# Altium schematic sheet Sheet2.SchDoc
size Tabloid
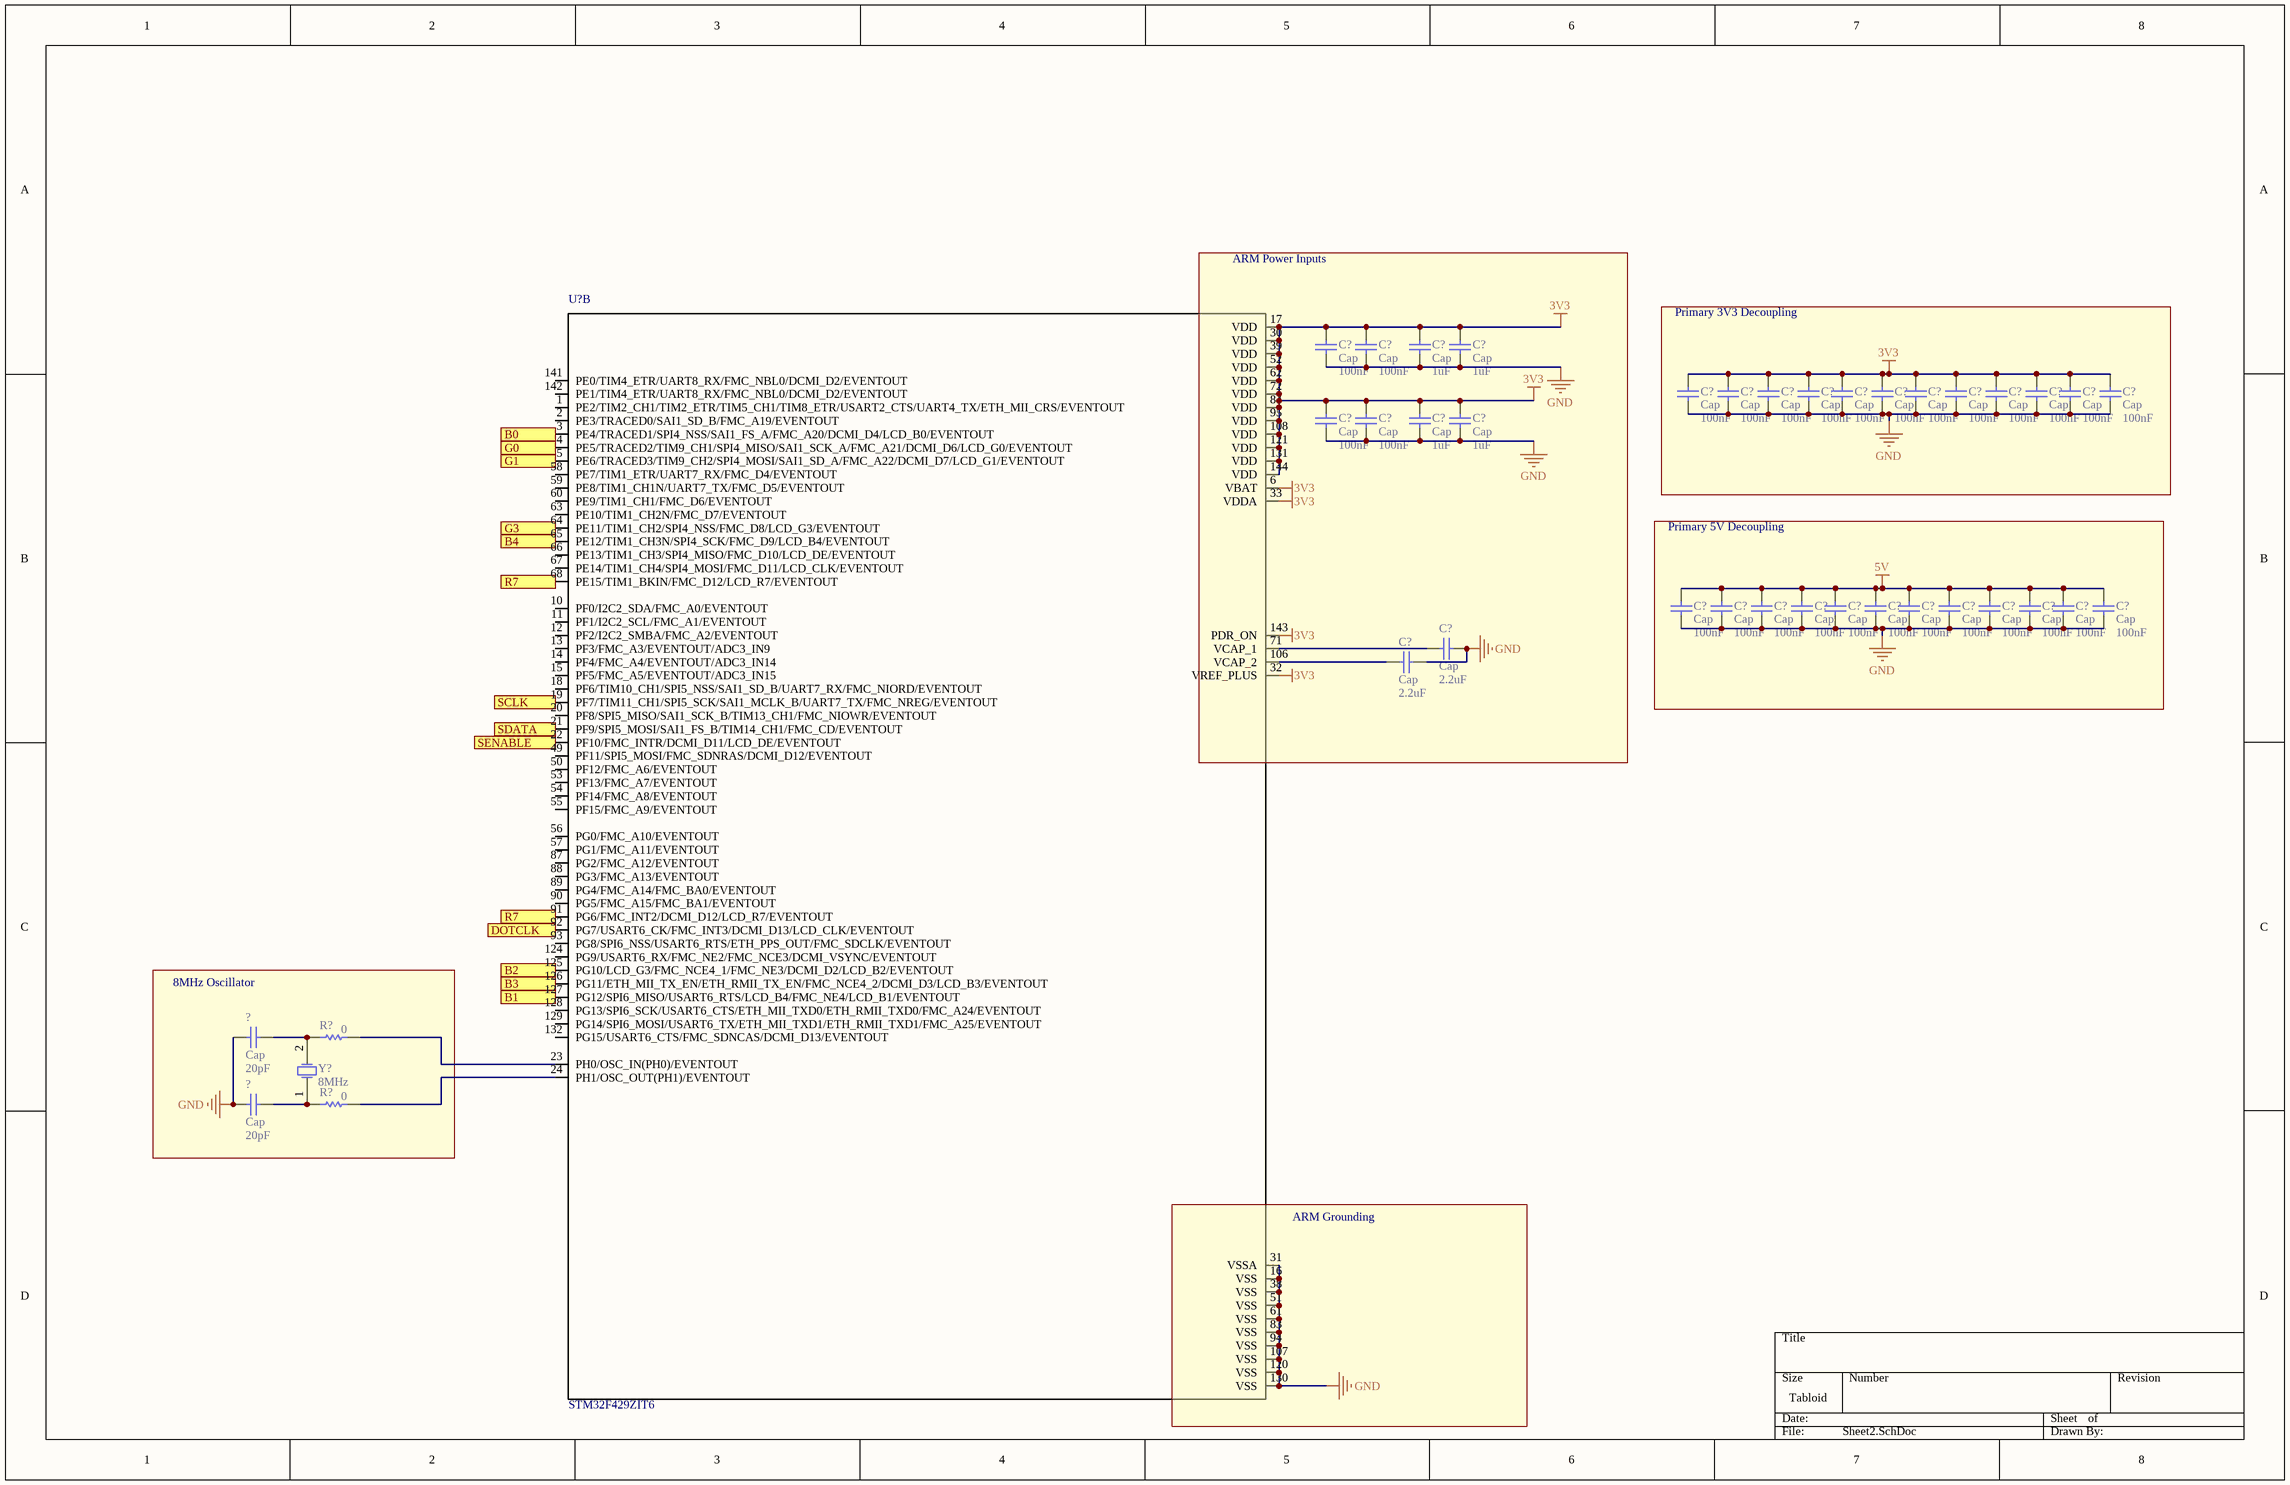
[diagram p0: Sheet2.SchDoc]

## Parts
(Parts that share a designator on the sheet are numbered #1, #2 ... from top to bottom, then left to right.)
?#1  Cap  value 20pF  [RAD-0.3]
?#2  Cap  value 20pF  [RAD-0.3]
C?#1  Cap  value 100nF  [RAD-0.3]
C?#2  Cap  value 100nF  [RAD-0.3]
C?#3  Cap  value 1uF  [RAD-0.3]
C?#4  Cap  value 1uF  [RAD-0.3]
C?#5  Cap  value 100nF  [RAD-0.3]
C?#6  Cap  value 100nF  [RAD-0.3]
C?#7  Cap  value 100nF  [RAD-0.3]
C?#8  Cap  value 100nF  [RAD-0.3]
C?#9  Cap  value 100nF  [RAD-0.3]
C?#10  Cap  value 100nF  [RAD-0.3]
C?#11  Cap  value 100nF  [RAD-0.3]
C?#12  Cap  value 100nF  [RAD-0.3]
C?#13  Cap  value 100nF  [RAD-0.3]
C?#14  Cap  value 100nF  [RAD-0.3]
C?#15  Cap  value 100nF  [RAD-0.3]
C?#16  Cap  value 100nF  [RAD-0.3]
C?#17  Cap  value 100nF  [RAD-0.3]
C?#18  Cap  value 100nF  [RAD-0.3]
C?#19  Cap  value 1uF  [RAD-0.3]
C?#20  Cap  value 1uF  [RAD-0.3]
C?#21  Cap  value 100nF  [RAD-0.3]
C?#22  Cap  value 100nF  [RAD-0.3]
C?#23  Cap  value 100nF  [RAD-0.3]
C?#24  Cap  value 100nF  [RAD-0.3]
C?#25  Cap  value 100nF  [RAD-0.3]
C?#26  Cap  value 100nF  [RAD-0.3]
C?#27  Cap  value 100nF  [RAD-0.3]
C?#28  Cap  value 100nF  [RAD-0.3]
C?#29  Cap  value 100nF  [RAD-0.3]
C?#30  Cap  value 100nF  [RAD-0.3]
C?#31  Cap  value 100nF  [RAD-0.3]
C?#32  Cap  value 100nF  [RAD-0.3]
C?#33  Cap  value 2.2uF  [RAD-0.3]
C?#34  Cap  value 2.2uF  [RAD-0.3]
R?#1  value 0  [AXIAL-0.3]  (hidden comment: Res1)
R?#2  value 0  [AXIAL-0.3]  (hidden comment: Res1)
U?  STM32F429ZIT6  [*QFP50P2200X2200X160-144N]  (part B of 2)
Y?  8MHz  [R38]

## Blocks framed on the sheet
ARM Power Inputs: C?#1-C?#4 C?#17-C?#20 C?#33 C?#34
Primary 3V3 Decoupling: C?#5-C?#16
Primary 5V Decoupling: C?#21-C?#32
8MHz Oscillator: ?#1 ?#2 R?#1 R?#2 Y?

## Ports
B0 (in), B1 (in), B2 (in), B3 (in), B4 (in), DOTCLK (in), G0 (in), G1 (in), G3 (in), R7 (in), SCLK (in), SDATA (in), SENABLE (in)

## Nets
3V3: C?#1.1 C?#2.1 C?#3.1 C?#4.1 C?#5.1 C?#6.1 C?#7.1 C?#8.1 C?#9.1 C?#10.1 C?#11.1 C?#12.1 C?#13.1 C?#14.1 C?#15.1 C?#16.1 C?#17.1 C?#18.1 C?#19.1 C?#20.1 U?.6(VBAT) U?.17(VDD) U?.30(VDD) U?.32(VREF_PLUS) U?.33(VDDA) U?.39(VDD) U?.52(VDD) U?.62(VDD) U?.72(VDD) U?.84(VDD) U?.95(VDD) U?.108(VDD) U?.121(VDD) U?.131(VDD) U?.143(PDR_ON) U?.144(VDD)
5V: C?#21.1 C?#22.1 C?#23.1 C?#24.1 C?#25.1 C?#26.1 C?#27.1 C?#28.1 C?#29.1 C?#30.1 C?#31.1 C?#32.1
GND: ?#1.2 ?#2.2 C?#1.2 C?#2.2 C?#3.2 C?#4.2 C?#5.2 C?#6.2 C?#7.2 C?#8.2 C?#9.2 C?#10.2 C?#11.2 C?#12.2 C?#13.2 C?#14.2 C?#15.2 C?#16.2 C?#17.2 C?#18.2 C?#19.2 C?#20.2 C?#21.2 C?#22.2 C?#23.2 C?#24.2 C?#25.2 C?#26.2 C?#27.2 C?#28.2 C?#29.2 C?#30.2 C?#31.2 C?#32.2 C?#33.1 C?#34.1 U?.16(VSS) U?.31(VSSA) U?.38(VSS) U?.51(VSS) U?.61(VSS) U?.83(VSS) U?.94(VSS) U?.107(VSS) U?.120(VSS) U?.130(VSS)
B0: U?.3(PE4/TRACED1/SPI4_NSS/SAI1_FS_A/FMC_A20/DCMI_D4/LCD_B0/EVENTOUT) ; port B0
B1: U?.127(PG12/SPI6_MISO/USART6_RTS/LCD_B4/FMC_NE4/LCD_B1/EVENTOUT) ; port B1
B2: U?.125(PG10/LCD_G3/FMC_NCE4_1/FMC_NE3/DCMI_D2/LCD_B2/EVENTOUT) ; port B2
B3: U?.126(PG11/ETH_MII_TX_EN/ETH_RMII_TX_EN/FMC_NCE4_2/DCMI_D3/LCD_B3/EVENTOUT) ; port B3
B4: U?.65(PE12/TIM1_CH3N/SPI4_SCK/FMC_D9/LCD_B4/EVENTOUT) ; port B4
DOTCLK: U?.92(PG7/USART6_CK/FMC_INT3/DCMI_D13/LCD_CLK/EVENTOUT) ; port DOTCLK
G0: U?.4(PE5/TRACED2/TIM9_CH1/SPI4_MISO/SAI1_SCK_A/FMC_A21/DCMI_D6/LCD_G0/EVENTOUT) ; port G0
G1: U?.5(PE6/TRACED3/TIM9_CH2/SPI4_MOSI/SAI1_SD_A/FMC_A22/DCMI_D7/LCD_G1/EVENTOUT) ; port G1
G3: U?.64(PE11/TIM1_CH2/SPI4_NSS/FMC_D8/LCD_G3/EVENTOUT) ; port G3
R7: U?.68(PE15/TIM1_BKIN/FMC_D12/LCD_R7/EVENTOUT) U?.91(PG6/FMC_INT2/DCMI_D12/LCD_R7/EVENTOUT) ; port R7
SCLK: U?.19(PF7/TIM11_CH1/SPI5_SCK/SAI1_MCLK_B/UART7_TX/FMC_NREG/EVENTOUT) ; port SCLK
SDATA: U?.21(PF9/SPI5_MOSI/SAI1_FS_B/TIM14_CH1/FMC_CD/EVENTOUT) ; port SDATA
SENABLE: U?.22(PF10/FMC_INTR/DCMI_D11/LCD_DE/EVENTOUT) ; port SENABLE
Net?#1_1: ?#1.1 R?#1.2 Y?.2(OSC2)
Net?#2_1: ?#2.1 R?#2.2 Y?.1(OSC1)
NetC?#33_2: C?#33.2 U?.71(VCAP_1)
NetC?#34_2: C?#34.2 U?.106(VCAP_2)
NetR?#1_1: R?#1.1 U?.23(PH0/OSC_IN(PH0)/EVENTOUT)
NetR?#2_1: R?#2.1 U?.24(PH1/OSC_OUT(PH1)/EVENTOUT)

Not connected (* = marked no-connect by the designer): U? 1(PE2/TIM2_CH1/TIM2_ETR/TIM5_CH1/TIM8_ETR/USART2_CTS/UART4_TX/ETH_MII_CRS/EVENTOUT) 2(PE3/TRACED0/SAI1_SD_B/FMC_A19/EVENTOUT) 10(PF0/I2C2_SDA/FMC_A0/EVENTOUT) 11(PF1/I2C2_SCL/FMC_A1/EVENTOUT) 12(PF2/I2C2_SMBA/FMC_A2/EVENTOUT) 13(PF3/FMC_A3/EVENTOUT/ADC3_IN9) 14(PF4/FMC_A4/EVENTOUT/ADC3_IN14) 15(PF5/FMC_A5/EVENTOUT/ADC3_IN15) 18(PF6/TIM10_CH1/SPI5_NSS/SAI1_SD_B/UART7_RX/FMC_NIORD/EVENTOUT) 20(PF8/SPI5_MISO/SAI1_SCK_B/TIM13_CH1/FMC_NIOWR/EVENTOUT) 49(PF11/SPI5_MOSI/FMC_SDNRAS/DCMI_D12/EVENTOUT) 50(PF12/FMC_A6/EVENTOUT) 53(PF13/FMC_A7/EVENTOUT) 54(PF14/FMC_A8/EVENTOUT) 55(PF15/FMC_A9/EVENTOUT) 56(PG0/FMC_A10/EVENTOUT) 57(PG1/FMC_A11/EVENTOUT) 58(PE7/TIM1_ETR/UART7_RX/FMC_D4/EVENTOUT) 59(PE8/TIM1_CH1N/UART7_TX/FMC_D5/EVENTOUT) 60(PE9/TIM1_CH1/FMC_D6/EVENTOUT) 63(PE10/TIM1_CH2N/FMC_D7/EVENTOUT) 66(PE13/TIM1_CH3/SPI4_MISO/FMC_D10/LCD_DE/EVENTOUT) 67(PE14/TIM1_CH4/SPI4_MOSI/FMC_D11/LCD_CLK/EVENTOUT) 87(PG2/FMC_A12/EVENTOUT) 88(PG3/FMC_A13/EVENTOUT) 89(PG4/FMC_A14/FMC_BA0/EVENTOUT) 90(PG5/FMC_A15/FMC_BA1/EVENTOUT) 93(PG8/SPI6_NSS/USART6_RTS/ETH_PPS_OUT/FMC_SDCLK/EVENTOUT) 124(PG9/USART6_RX/FMC_NE2/FMC_NCE3/DCMI_VSYNC/EVENTOUT) 128(PG13/SPI6_SCK/USART6_CTS/ETH_MII_TXD0/ETH_RMII_TXD0/FMC_A24/EVENTOUT) 129(PG14/SPI6_MOSI/USART6_TX/ETH_MII_TXD1/ETH_RMII_TXD1/FMC_A25/EVENTOUT) 132(PG15/USART6_CTS/FMC_SDNCAS/DCMI_D13/EVENTOUT) 141(PE0/TIM4_ETR/UART8_RX/FMC_NBL0/DCMI_D2/EVENTOUT) 142(PE1/TIM4_ETR/UART8_RX/FMC_NBL0/DCMI_D2/EVENTOUT)

## Notes on the sheet
- (near U?) ARM Grounding

## Library data of the parts
?#1 ?#2 C?#1-C?#34 = Cap: Capacitor; Published: 8-Jun-2000; LatestRevisionDate: 17-Jul-2002; LatestRevisionNote: Re-released for DXP Platform.; PackageReference: RAD-0.3; Publisher: Altium Limited; PackageDescription: Radial Cap, Thru-Hole; 2 Leads; 0.3 in Pin Spacing
R?#1 R?#2 = Res1: Resistor; Published: 8-Jun-2000; LatestRevisionDate: 17-Jul-2002; LatestRevisionNote: Re-released for DXP Platform.; PackageReference: AXIAL-0.3; Publisher: Altium Limited; PackageDescription: Axial Device, Thru-Hole; 2 Leads; 0.3 in Pin Spacing
U? = STM32F429ZIT6: High-performance and DSP with FPU, ARM Cortex-M4 MCU with 2 Mbytes Flash, 180 MHz CPU, Art Accelerator, SDRAM, TFT; MF: STMicroelectronics; Digi-Key_Part_Number: 497-14053-ND; SnapEDA_Link: https://www.snapeda.com/parts/STM32F429ZIT6/STMicroelectronics/view-part/?ref=snap; MP: STM32F429ZIT6; Package: LQFP-144 STMicroelectronics; Digi-Key_Purchase_URL: https://www.digikey.com/product-detail/en/stmicroelectronics/STM32F429ZIT6/497-14053-ND/4357427?utm_source=snapeda&utm_medium=aggregator&utm_campaign=symbol; Value: *
Y? = XTAL: Crystal Oscillator; Published: 8-Jun-2000; LatestRevisionDate: 17-Jul-2002; LatestRevisionNote: Re-released for DXP Platform.; PackageReference: R38; Publisher: Altium Limited; PackageDescription: Crystal, Thru-Hole; 2 Leads; Body 3.1 x 8.2 mm (Dia.xH)